# Altium schematic sheet Current-LoadSwitches 1V8.SchDoc
size A
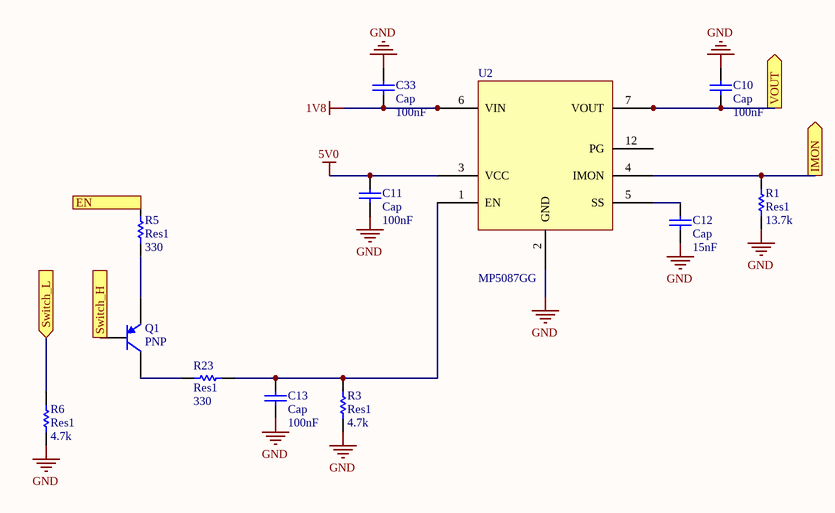
[diagram p0: Current-LoadSwitches 1V8.SchDoc]

## Parts
C10  Cap  value 100nF  [0402-A]
C11  Cap  value 100nF  [0402-A]
C12  Cap  value 15nF  [0402-A]
C13  Cap  value 100nF  [0402-A]
C33  Cap  value 100nF  [0402-A]
Q1  PNP  [SOT-23B_N]
R1  Res1  value 13.7k  [0402-A]
R3  Res1  value 4.7k  [0402-A]
R5  Res1  value 330  [0402-A]
R6  Res1  value 4.7k  [0402-A]
R23  Res1  value 330  [0402-A]
U2  MP5087GG  [MP5087GG-Z]

## Ports
EN (in), IMON (out), Switch_H (out), Switch_L (in), VOUT (out)

## Nets
1V8: C33.1 U2.6(VIN) U2.11(VOUT)
5V0: C11.2 U2.3(VCC)
GND: C10.2 C11.1 C12.1 C13.1 C33.2 R1.1 R3.1 R6.1 U2.2(GND)
EN: R5.2 ; port EN
IMON: R1.2 U2.4(IMON) ; port IMON
Switch_H: Q1.2(B) ; port Switch_H
Switch_L: R6.2 ; port Switch_L
VOUT: C10.1 U2.7(VOUT) U2.8(VOUT) U2.9(VOUT) U2.10(VOUT) ; port VOUT
NetC12_2: C12.2 U2.5(SS)
NetC13_2: C13.2 R3.2 R23.2 U2.1(EN)
NetQ1_1: Q1.1(C) R23.1
NetQ1_3: Q1.3(E) R5.1

Not connected (* = marked no-connect by the designer): U2 12(PG)

## Library data of the parts
C10-C13 C33 = Cap: Capacitor; Published: 8-Jun-2000; LatestRevisionDate: 17-Jul-2002; LatestRevisionNote: Re-released for DXP Platform.; PackageReference: RAD-0.3; Publisher: Altium Limited; PackageDescription: Radial Cap, Thru-Hole; 2 Leads; 0.3 in Pin Spacing
Q1 = PNP: PNP Bipolar Transistor; Published: 8-Jun-2000; LatestRevisionDate: 29-May-2009; LatestRevisionNote: IPC-7351 Footprint Added.; PackageVersion: Aug-1999; PackageReference: SOT-23B; Publisher: Altium Limited; PackageDescription: 3-Pin SOT-23 Package 0.95 mm Pitch, 2.4 mm Lead Span
R1 R3 R5 R6 R23 = Res1: Resistor; Published: 8-Jun-2000; LatestRevisionDate: 17-Jul-2002; LatestRevisionNote: Re-released for DXP Platform.; PackageReference: AXIAL-0.3; Publisher: Altium Limited; PackageDescription: Axial Device, Thru-Hole; 2 Leads; 0.3 in Pin Spacing
U2 = Component_1